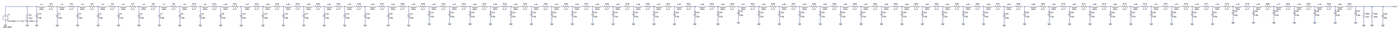
[diagram p0: schematic 64 cell_pc=1p.asc, whole sheet]
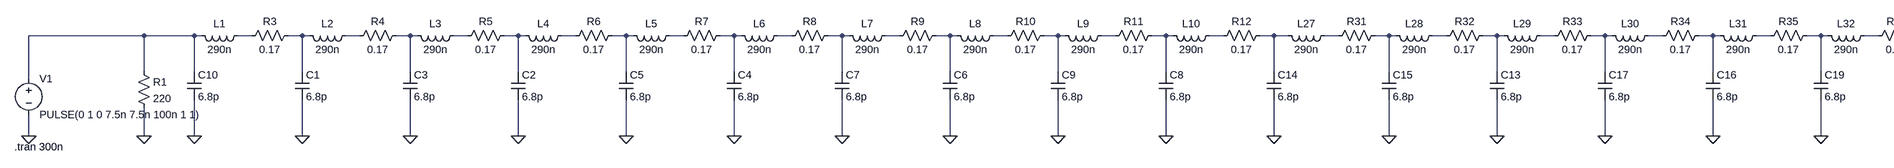
[diagram p1: schematic 64 cell_pc=1p.asc, part, row 1 of 1, column 1 of 4]
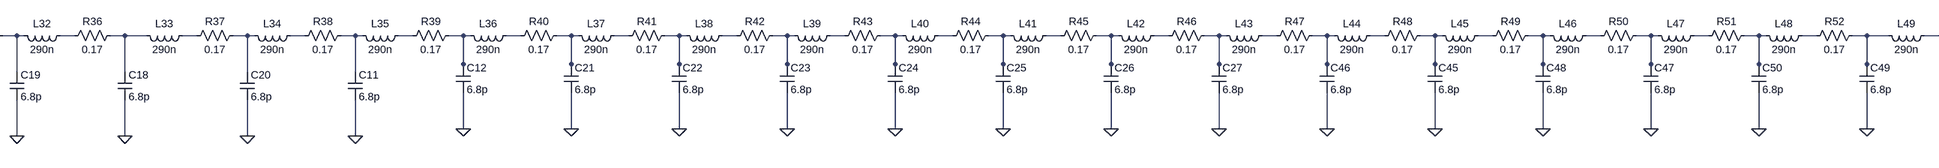
[diagram p2: schematic 64 cell_pc=1p.asc, part, row 1 of 1, column 2 of 4]
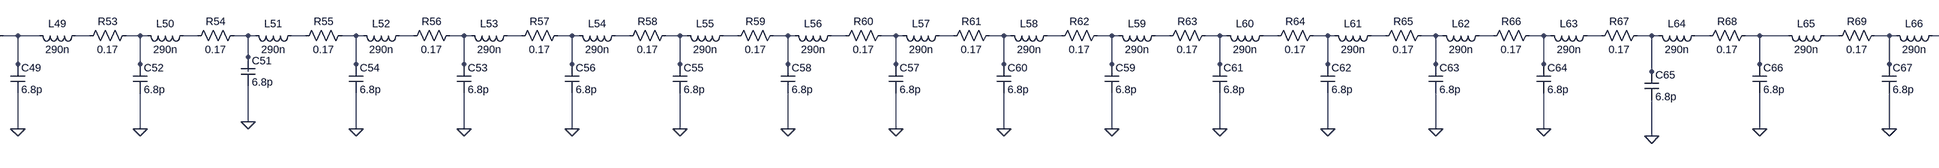
[diagram p3: schematic 64 cell_pc=1p.asc, part, row 1 of 1, column 3 of 4]
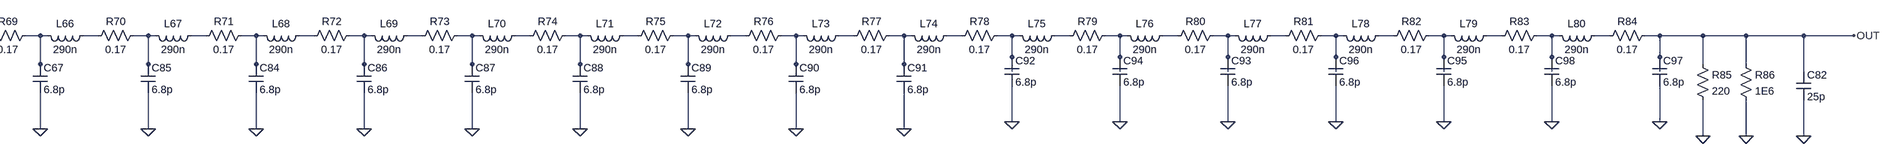
[diagram p4: schematic 64 cell_pc=1p.asc, part, row 1 of 1, column 4 of 4]
64 cell_pc=1p.asc, the LTspice schematic file:
Version 4
SHEET 1 14948 1092
WIRE -1152 48 -1408 48
WIRE -1040 48 -1152 48
WIRE -1024 48 -1040 48
WIRE -912 48 -944 48
WIRE -800 48 -832 48
WIRE -784 48 -800 48
WIRE -672 48 -704 48
WIRE -560 48 -592 48
WIRE -544 48 -560 48
WIRE -432 48 -464 48
WIRE -320 48 -352 48
WIRE -304 48 -320 48
WIRE -192 48 -224 48
WIRE -80 48 -112 48
WIRE -64 48 -80 48
WIRE 48 48 16 48
WIRE 160 48 128 48
WIRE 176 48 160 48
WIRE 288 48 256 48
WIRE 400 48 368 48
WIRE 416 48 400 48
WIRE 528 48 496 48
WIRE 640 48 608 48
WIRE 656 48 640 48
WIRE 768 48 736 48
WIRE 880 48 848 48
WIRE 896 48 880 48
WIRE 1008 48 976 48
WIRE 1120 48 1088 48
WIRE 1136 48 1120 48
WIRE 1248 48 1216 48
WIRE 1360 48 1328 48
WIRE 1392 48 1360 48
WIRE 1504 48 1472 48
WIRE 1616 48 1584 48
WIRE 1632 48 1616 48
WIRE 1744 48 1712 48
WIRE 1856 48 1824 48
WIRE 1872 48 1856 48
WIRE 1984 48 1952 48
WIRE 2096 48 2064 48
WIRE 2112 48 2096 48
WIRE 2224 48 2192 48
WIRE 2336 48 2304 48
WIRE 2352 48 2336 48
WIRE 2464 48 2432 48
WIRE 2576 48 2544 48
WIRE 2592 48 2576 48
WIRE 2704 48 2672 48
WIRE 2816 48 2784 48
WIRE 2864 48 2816 48
WIRE 2976 48 2944 48
WIRE 3088 48 3056 48
WIRE 3104 48 3088 48
WIRE 3216 48 3184 48
WIRE 3328 48 3296 48
WIRE 3344 48 3328 48
WIRE 3456 48 3424 48
WIRE 3568 48 3536 48
WIRE 3584 48 3568 48
WIRE 3696 48 3664 48
WIRE 3808 48 3776 48
WIRE 3824 48 3808 48
WIRE 3936 48 3904 48
WIRE 4048 48 4016 48
WIRE 4064 48 4048 48
WIRE 4176 48 4144 48
WIRE 4288 48 4256 48
WIRE 4304 48 4288 48
WIRE 4416 48 4384 48
WIRE 4528 48 4496 48
WIRE 4544 48 4528 48
WIRE 4656 48 4624 48
WIRE 4768 48 4736 48
WIRE 4784 48 4768 48
WIRE 4896 48 4864 48
WIRE 5008 48 4976 48
WIRE 5024 48 5008 48
WIRE 5136 48 5104 48
WIRE 5248 48 5216 48
WIRE 5264 48 5248 48
WIRE 5376 48 5344 48
WIRE 5488 48 5456 48
WIRE 5504 48 5488 48
WIRE 5616 48 5584 48
WIRE 5728 48 5696 48
WIRE 5744 48 5728 48
WIRE 5856 48 5824 48
WIRE 5968 48 5936 48
WIRE 5984 48 5968 48
WIRE 6096 48 6064 48
WIRE 6208 48 6176 48
WIRE 6224 48 6208 48
WIRE 6336 48 6304 48
WIRE 6448 48 6416 48
WIRE 6464 48 6448 48
WIRE 6576 48 6544 48
WIRE 6688 48 6656 48
WIRE 6736 48 6688 48
WIRE 6848 48 6816 48
WIRE 6960 48 6928 48
WIRE 6976 48 6960 48
WIRE 7088 48 7056 48
WIRE 7200 48 7168 48
WIRE 7216 48 7200 48
WIRE 7328 48 7296 48
WIRE 7440 48 7408 48
WIRE 7456 48 7440 48
WIRE 7568 48 7536 48
WIRE 7680 48 7648 48
WIRE 7696 48 7680 48
WIRE 7808 48 7776 48
WIRE 7920 48 7888 48
WIRE 7936 48 7920 48
WIRE 8048 48 8016 48
WIRE 8160 48 8128 48
WIRE 8176 48 8160 48
WIRE 8288 48 8256 48
WIRE 8400 48 8368 48
WIRE 8416 48 8400 48
WIRE 8528 48 8496 48
WIRE 8640 48 8608 48
WIRE 8656 48 8640 48
WIRE 8768 48 8736 48
WIRE 8880 48 8848 48
WIRE 8896 48 8880 48
WIRE 9008 48 8976 48
WIRE 9120 48 9088 48
WIRE 9136 48 9120 48
WIRE 9248 48 9216 48
WIRE 9360 48 9328 48
WIRE 9376 48 9360 48
WIRE 9488 48 9456 48
WIRE 9600 48 9568 48
WIRE 9616 48 9600 48
WIRE 9728 48 9696 48
WIRE 9840 48 9808 48
WIRE 9856 48 9840 48
WIRE 9968 48 9936 48
WIRE 10080 48 10048 48
WIRE 10096 48 10080 48
WIRE 10208 48 10176 48
WIRE 10320 48 10288 48
WIRE 10336 48 10320 48
WIRE 10448 48 10416 48
WIRE 10560 48 10528 48
WIRE 10624 48 10560 48
WIRE 10736 48 10704 48
WIRE 10848 48 10816 48
WIRE 10864 48 10848 48
WIRE 10976 48 10944 48
WIRE 11088 48 11056 48
WIRE 11104 48 11088 48
WIRE 11216 48 11184 48
WIRE 11328 48 11296 48
WIRE 11344 48 11328 48
WIRE 11456 48 11424 48
WIRE 11568 48 11536 48
WIRE 11584 48 11568 48
WIRE 11696 48 11664 48
WIRE 11808 48 11776 48
WIRE 11824 48 11808 48
WIRE 11936 48 11904 48
WIRE 12048 48 12016 48
WIRE 12064 48 12048 48
WIRE 12176 48 12144 48
WIRE 12288 48 12256 48
WIRE 12304 48 12288 48
WIRE 12416 48 12384 48
WIRE 12528 48 12496 48
WIRE 12544 48 12528 48
WIRE 12656 48 12624 48
WIRE 12768 48 12736 48
WIRE 12784 48 12768 48
WIRE 12896 48 12864 48
WIRE 13008 48 12976 48
WIRE 13024 48 13008 48
WIRE 13136 48 13104 48
WIRE 13248 48 13216 48
WIRE 13264 48 13248 48
WIRE 13376 48 13344 48
WIRE 13488 48 13456 48
WIRE 13504 48 13488 48
WIRE 13616 48 13584 48
WIRE 13728 48 13696 48
WIRE 13744 48 13728 48
WIRE 13856 48 13824 48
WIRE 13968 48 13936 48
WIRE 13984 48 13968 48
WIRE 14096 48 14064 48
WIRE 14208 48 14176 48
WIRE 14224 48 14208 48
WIRE 14336 48 14304 48
WIRE 14448 48 14416 48
WIRE 14544 48 14448 48
WIRE 14640 48 14544 48
WIRE 14768 48 14640 48
WIRE 14880 48 14768 48
WIRE 7200 96 7200 48
WIRE 13008 96 13008 48
WIRE 13248 96 13248 48
WIRE 13488 96 13488 48
WIRE 13728 96 13728 48
WIRE 13968 96 13968 48
WIRE 14208 96 14208 48
WIRE 14448 96 14448 48
WIRE 3568 112 3568 48
WIRE 3808 112 3808 48
WIRE 4048 112 4048 48
WIRE 4288 112 4288 48
WIRE 4528 112 4528 48
WIRE 4768 112 4768 48
WIRE 5008 112 5008 48
WIRE 5248 112 5248 48
WIRE 5488 112 5488 48
WIRE 5728 112 5728 48
WIRE 5968 112 5968 48
WIRE 6208 112 6208 48
WIRE 6448 112 6448 48
WIRE 6688 112 6688 48
WIRE 6960 112 6960 48
WIRE 7440 112 7440 48
WIRE 7680 112 7680 48
WIRE 7920 112 7920 48
WIRE 8160 112 8160 48
WIRE 8400 112 8400 48
WIRE 8640 112 8640 48
WIRE 8880 112 8880 48
WIRE 9120 112 9120 48
WIRE 9360 112 9360 48
WIRE 9600 112 9600 48
WIRE 9840 112 9840 48
WIRE 10080 112 10080 48
WIRE 10560 112 10560 48
WIRE 10848 112 10848 48
WIRE 11088 112 11088 48
WIRE 11328 112 11328 48
WIRE 11568 112 11568 48
WIRE 11808 112 11808 48
WIRE 12048 112 12048 48
WIRE 12288 112 12288 48
WIRE 12528 112 12528 48
WIRE 12768 112 12768 48
WIRE 14544 112 14544 48
WIRE 14640 112 14640 48
WIRE -1152 128 -1152 48
WIRE -1040 128 -1040 48
WIRE -800 128 -800 48
WIRE -560 128 -560 48
WIRE -320 128 -320 48
WIRE -80 128 -80 48
WIRE 160 128 160 48
WIRE 400 128 400 48
WIRE 640 128 640 48
WIRE 880 128 880 48
WIRE 1120 128 1120 48
WIRE 1360 128 1360 48
WIRE 1616 128 1616 48
WIRE 1856 128 1856 48
WIRE 2096 128 2096 48
WIRE 2336 128 2336 48
WIRE 2576 128 2576 48
WIRE 2816 128 2816 48
WIRE 3088 128 3088 48
WIRE 3328 128 3328 48
WIRE 3568 128 3568 112
WIRE 3808 128 3808 112
WIRE 4048 128 4048 112
WIRE 4288 128 4288 112
WIRE 4528 128 4528 112
WIRE 4768 128 4768 112
WIRE 5008 128 5008 112
WIRE 5248 128 5248 112
WIRE 5488 128 5488 112
WIRE 5728 128 5728 112
WIRE 5968 128 5968 112
WIRE 6208 128 6208 112
WIRE 6448 128 6448 112
WIRE 6688 128 6688 112
WIRE 6960 128 6960 112
WIRE 7200 128 7200 96
WIRE 7440 128 7440 112
WIRE 7680 128 7680 112
WIRE 7920 128 7920 112
WIRE 8160 128 8160 112
WIRE 8400 128 8400 112
WIRE 8640 128 8640 112
WIRE 8880 128 8880 112
WIRE 9120 128 9120 112
WIRE 9360 128 9360 112
WIRE 9600 128 9600 112
WIRE 9840 128 9840 112
WIRE 10080 128 10080 112
WIRE 10320 128 10320 48
WIRE 10560 128 10560 112
WIRE 10848 128 10848 112
WIRE 11088 128 11088 112
WIRE 11328 128 11328 112
WIRE 11568 128 11568 112
WIRE 11808 128 11808 112
WIRE 12048 128 12048 112
WIRE 12288 128 12288 112
WIRE 12528 128 12528 112
WIRE 12768 128 12768 112
WIRE 13008 128 13008 96
WIRE 13248 128 13248 96
WIRE 13488 128 13488 96
WIRE 13728 128 13728 96
WIRE 13968 128 13968 96
WIRE 14208 128 14208 96
WIRE 14448 128 14448 96
WIRE 14768 128 14768 48
WIRE -1408 144 -1408 48
WIRE 10320 144 10320 128
WIRE 7200 240 7200 160
WIRE 13008 240 13008 160
WIRE 13248 240 13248 160
WIRE 13488 240 13488 160
WIRE 13728 240 13728 160
WIRE 13968 240 13968 160
WIRE 14208 240 14208 160
WIRE 14448 240 14448 160
WIRE 3568 256 3568 176
WIRE 3808 256 3808 176
WIRE 4048 256 4048 176
WIRE 4288 256 4288 176
WIRE 4528 256 4528 176
WIRE 4768 256 4768 176
WIRE 5008 256 5008 176
WIRE 5248 256 5248 176
WIRE 5488 256 5488 176
WIRE 5728 256 5728 176
WIRE 5968 256 5968 176
WIRE 6208 256 6208 176
WIRE 6448 256 6448 176
WIRE 6688 256 6688 176
WIRE 6960 256 6960 176
WIRE 7440 256 7440 176
WIRE 7680 256 7680 176
WIRE 7920 256 7920 176
WIRE 8160 256 8160 176
WIRE 8400 256 8400 176
WIRE 8640 256 8640 176
WIRE 8880 256 8880 176
WIRE 9120 256 9120 176
WIRE 9360 256 9360 176
WIRE 9600 256 9600 176
WIRE 9840 256 9840 176
WIRE 10080 256 10080 176
WIRE 10560 256 10560 176
WIRE 10848 256 10848 176
WIRE 11088 256 11088 176
WIRE 11328 256 11328 176
WIRE 11568 256 11568 176
WIRE 11808 256 11808 176
WIRE 12048 256 12048 176
WIRE 12288 256 12288 176
WIRE 12528 256 12528 176
WIRE 12768 256 12768 176
WIRE -1408 272 -1408 224
WIRE -1152 272 -1152 208
WIRE -1040 272 -1040 192
WIRE -800 272 -800 192
WIRE -560 272 -560 192
WIRE -320 272 -320 192
WIRE -80 272 -80 192
WIRE 160 272 160 192
WIRE 400 272 400 192
WIRE 640 272 640 192
WIRE 880 272 880 192
WIRE 1120 272 1120 192
WIRE 1360 272 1360 192
WIRE 1616 272 1616 192
WIRE 1856 272 1856 192
WIRE 2096 272 2096 192
WIRE 2336 272 2336 192
WIRE 2576 272 2576 192
WIRE 2816 272 2816 192
WIRE 3088 272 3088 192
WIRE 3328 272 3328 192
WIRE 10320 272 10320 192
WIRE 14544 272 14544 192
WIRE 14640 272 14640 192
WIRE 14768 272 14768 192
FLAG -1408 272 0
FLAG -1040 272 0
FLAG -800 272 0
FLAG 14544 272 0
FLAG 14640 272 0
FLAG 14768 272 0
FLAG 14880 48 OUT
FLAG -1152 272 0
FLAG -560 272 0
FLAG -320 272 0
FLAG -80 272 0
FLAG 160 272 0
FLAG 400 272 0
FLAG 640 272 0
FLAG 880 272 0
FLAG 1120 272 0
FLAG 1360 272 0
FLAG 1616 272 0
FLAG 1856 272 0
FLAG 2096 272 0
FLAG 2336 272 0
FLAG 2576 272 0
FLAG 2816 272 0
FLAG 3088 272 0
FLAG 5488 256 0
FLAG 5728 256 0
FLAG 5968 256 0
FLAG 6208 256 0
FLAG 6448 256 0
FLAG 6688 256 0
FLAG 7200 240 0
FLAG 6960 256 0
FLAG 7440 256 0
FLAG 7680 256 0
FLAG 7920 256 0
FLAG 8160 256 0
FLAG 8400 256 0
FLAG 8640 256 0
FLAG 8880 256 0
FLAG 9120 256 0
FLAG 9360 256 0
FLAG 9600 256 0
FLAG 9840 256 0
FLAG 10080 256 0
FLAG 10320 272 0
FLAG 10560 256 0
FLAG 10848 256 0
FLAG 13248 240 0
FLAG 13488 240 0
FLAG 13728 240 0
FLAG 13968 240 0
FLAG 14208 240 0
FLAG 14448 240 0
FLAG 11088 256 0
FLAG 11328 256 0
FLAG 11568 256 0
FLAG 11808 256 0
FLAG 12048 256 0
FLAG 12288 256 0
FLAG 12528 256 0
FLAG 12768 256 0
FLAG 13008 240 0
FLAG 3328 272 0
FLAG 3568 256 0
FLAG 3808 256 0
FLAG 4048 256 0
FLAG 4288 256 0
FLAG 4528 256 0
FLAG 4768 256 0
FLAG 5008 256 0
FLAG 5248 256 0
SYMBOL voltage -1408 128 R0
WINDOW 123 0 0 Left 0
WINDOW 39 0 0 Left 0
SYMATTR InstName V1
SYMATTR Value PULSE(0 1 0 7.5n 7.5n 100n 1 1)
SYMBOL ind -928 32 R90
WINDOW 0 5 56 VBottom 2
WINDOW 3 32 56 VTop 2
SYMATTR InstName L1
SYMATTR Value 290n
SYMBOL res -816 32 R90
WINDOW 0 0 56 VBottom 2
WINDOW 3 32 56 VTop 2
SYMATTR InstName R3
SYMATTR Value 0.17
SYMBOL cap -816 128 R0
SYMATTR InstName C1
SYMATTR Value 6.8p
SYMATTR SpiceLine Cpar=1p
SYMBOL ind -688 32 R90
WINDOW 0 5 56 VBottom 2
WINDOW 3 32 56 VTop 2
SYMATTR InstName L2
SYMATTR Value 290n
SYMBOL res -576 32 R90
WINDOW 0 0 56 VBottom 2
WINDOW 3 32 56 VTop 2
SYMATTR InstName R4
SYMATTR Value 0.17
SYMBOL ind -448 32 R90
WINDOW 0 5 56 VBottom 2
WINDOW 3 32 56 VTop 2
SYMATTR InstName L3
SYMATTR Value 290n
SYMBOL res -336 32 R90
WINDOW 0 0 56 VBottom 2
WINDOW 3 32 56 VTop 2
SYMATTR InstName R5
SYMATTR Value 0.17
SYMBOL ind -208 32 R90
WINDOW 0 5 56 VBottom 2
WINDOW 3 32 56 VTop 2
SYMATTR InstName L4
SYMATTR Value 290n
SYMBOL res -96 32 R90
WINDOW 0 0 56 VBottom 2
WINDOW 3 32 56 VTop 2
SYMATTR InstName R6
SYMATTR Value 0.17
SYMBOL ind 32 32 R90
WINDOW 0 5 56 VBottom 2
WINDOW 3 32 56 VTop 2
SYMATTR InstName L5
SYMATTR Value 290n
SYMBOL res 144 32 R90
WINDOW 0 0 56 VBottom 2
WINDOW 3 32 56 VTop 2
SYMATTR InstName R7
SYMATTR Value 0.17
SYMBOL ind 272 32 R90
WINDOW 0 5 56 VBottom 2
WINDOW 3 32 56 VTop 2
SYMATTR InstName L6
SYMATTR Value 290n
SYMBOL res 384 32 R90
WINDOW 0 0 56 VBottom 2
WINDOW 3 32 56 VTop 2
SYMATTR InstName R8
SYMATTR Value 0.17
SYMBOL ind 512 32 R90
WINDOW 0 5 56 VBottom 2
WINDOW 3 32 56 VTop 2
SYMATTR InstName L7
SYMATTR Value 290n
SYMBOL res 624 32 R90
WINDOW 0 0 56 VBottom 2
WINDOW 3 32 56 VTop 2
SYMATTR InstName R9
SYMATTR Value 0.17
SYMBOL ind 752 32 R90
WINDOW 0 5 56 VBottom 2
WINDOW 3 32 56 VTop 2
SYMATTR InstName L8
SYMATTR Value 290n
SYMBOL res 864 32 R90
WINDOW 0 0 56 VBottom 2
WINDOW 3 32 56 VTop 2
SYMATTR InstName R10
SYMATTR Value 0.17
SYMBOL ind 992 32 R90
WINDOW 0 5 56 VBottom 2
WINDOW 3 32 56 VTop 2
SYMATTR InstName L9
SYMATTR Value 290n
SYMBOL res 1104 32 R90
WINDOW 0 0 56 VBottom 2
WINDOW 3 32 56 VTop 2
SYMATTR InstName R11
SYMATTR Value 0.17
SYMBOL ind 1232 32 R90
WINDOW 0 5 56 VBottom 2
WINDOW 3 32 56 VTop 2
SYMATTR InstName L10
SYMATTR Value 290n
SYMBOL res 1344 32 R90
WINDOW 0 0 56 VBottom 2
WINDOW 3 32 56 VTop 2
SYMATTR InstName R12
SYMATTR Value 0.17
SYMBOL ind 1488 32 R90
WINDOW 0 5 56 VBottom 2
WINDOW 3 32 56 VTop 2
SYMATTR InstName L27
SYMATTR Value 290n
SYMBOL res 1600 32 R90
WINDOW 0 0 56 VBottom 2
WINDOW 3 32 56 VTop 2
SYMATTR InstName R31
SYMATTR Value 0.17
SYMBOL ind 1728 32 R90
WINDOW 0 5 56 VBottom 2
WINDOW 3 32 56 VTop 2
SYMATTR InstName L28
SYMATTR Value 290n
SYMBOL res 1840 32 R90
WINDOW 0 0 56 VBottom 2
WINDOW 3 32 56 VTop 2
SYMATTR InstName R32
SYMATTR Value 0.17
SYMBOL ind 1968 32 R90
WINDOW 0 5 56 VBottom 2
WINDOW 3 32 56 VTop 2
SYMATTR InstName L29
SYMATTR Value 290n
SYMBOL res 2080 32 R90
WINDOW 0 0 56 VBottom 2
WINDOW 3 32 56 VTop 2
SYMATTR InstName R33
SYMATTR Value 0.17
SYMBOL ind 2208 32 R90
WINDOW 0 5 56 VBottom 2
WINDOW 3 32 56 VTop 2
SYMATTR InstName L30
SYMATTR Value 290n
SYMBOL res 2320 32 R90
WINDOW 0 0 56 VBottom 2
WINDOW 3 32 56 VTop 2
SYMATTR InstName R34
SYMATTR Value 0.17
SYMBOL ind 2448 32 R90
WINDOW 0 5 56 VBottom 2
WINDOW 3 32 56 VTop 2
SYMATTR InstName L31
SYMATTR Value 290n
SYMBOL res 2560 32 R90
WINDOW 0 0 56 VBottom 2
WINDOW 3 32 56 VTop 2
SYMATTR InstName R35
SYMATTR Value 0.17
SYMBOL ind 2688 32 R90
WINDOW 0 5 56 VBottom 2
WINDOW 3 32 56 VTop 2
SYMATTR InstName L32
SYMATTR Value 290n
SYMBOL res 2800 32 R90
WINDOW 0 0 56 VBottom 2
WINDOW 3 32 56 VTop 2
SYMATTR InstName R36
SYMATTR Value 0.17
SYMBOL ind 2960 32 R90
WINDOW 0 5 56 VBottom 2
WINDOW 3 32 56 VTop 2
SYMATTR InstName L33
SYMATTR Value 290n
SYMBOL res 3072 32 R90
WINDOW 0 0 56 VBottom 2
WINDOW 3 32 56 VTop 2
SYMATTR InstName R37
SYMATTR Value 0.17
SYMBOL ind 3200 32 R90
WINDOW 0 5 56 VBottom 2
WINDOW 3 32 56 VTop 2
SYMATTR InstName L34
SYMATTR Value 290n
SYMBOL res 3312 32 R90
WINDOW 0 0 56 VBottom 2
WINDOW 3 32 56 VTop 2
SYMATTR InstName R38
SYMATTR Value 0.17
SYMBOL ind 3440 32 R90
WINDOW 0 5 56 VBottom 2
WINDOW 3 32 56 VTop 2
SYMATTR InstName L35
SYMATTR Value 290n
SYMBOL res 3552 32 R90
WINDOW 0 0 56 VBottom 2
WINDOW 3 32 56 VTop 2
SYMATTR InstName R39
SYMATTR Value 0.17
SYMBOL ind 3680 32 R90
WINDOW 0 5 56 VBottom 2
WINDOW 3 32 56 VTop 2
SYMATTR InstName L36
SYMATTR Value 290n
SYMBOL res 3792 32 R90
WINDOW 0 0 56 VBottom 2
WINDOW 3 32 56 VTop 2
SYMATTR InstName R40
SYMATTR Value 0.17
SYMBOL ind 3920 32 R90
WINDOW 0 5 56 VBottom 2
WINDOW 3 32 56 VTop 2
SYMATTR InstName L37
SYMATTR Value 290n
SYMBOL res 4032 32 R90
WINDOW 0 0 56 VBottom 2
WINDOW 3 32 56 VTop 2
SYMATTR InstName R41
SYMATTR Value 0.17
SYMBOL ind 4160 32 R90
WINDOW 0 5 56 VBottom 2
WINDOW 3 32 56 VTop 2
SYMATTR InstName L38
SYMATTR Value 290n
SYMBOL res 4272 32 R90
WINDOW 0 0 56 VBottom 2
WINDOW 3 32 56 VTop 2
SYMATTR InstName R42
SYMATTR Value 0.17
SYMBOL ind 4400 32 R90
WINDOW 0 5 56 VBottom 2
WINDOW 3 32 56 VTop 2
SYMATTR InstName L39
SYMATTR Value 290n
SYMBOL res 4512 32 R90
WINDOW 0 0 56 VBottom 2
WINDOW 3 32 56 VTop 2
SYMATTR InstName R43
SYMATTR Value 0.17
SYMBOL ind 4640 32 R90
WINDOW 0 5 56 VBottom 2
WINDOW 3 32 56 VTop 2
SYMATTR InstName L40
SYMATTR Value 290n
SYMBOL res 4752 32 R90
WINDOW 0 0 56 VBottom 2
WINDOW 3 32 56 VTop 2
SYMATTR InstName R44
SYMATTR Value 0.17
SYMBOL ind 4880 32 R90
WINDOW 0 5 56 VBottom 2
WINDOW 3 32 56 VTop 2
SYMATTR InstName L41
SYMATTR Value 290n
SYMBOL res 4992 32 R90
WINDOW 0 0 56 VBottom 2
WINDOW 3 32 56 VTop 2
SYMATTR InstName R45
SYMATTR Value 0.17
SYMBOL ind 5120 32 R90
WINDOW 0 5 56 VBottom 2
WINDOW 3 32 56 VTop 2
SYMATTR InstName L42
SYMATTR Value 290n
SYMBOL res 5232 32 R90
WINDOW 0 0 56 VBottom 2
WINDOW 3 32 56 VTop 2
SYMATTR InstName R46
SYMATTR Value 0.17
SYMBOL ind 5360 32 R90
WINDOW 0 5 56 VBottom 2
WINDOW 3 32 56 VTop 2
SYMATTR InstName L43
SYMATTR Value 290n
SYMBOL res 5472 32 R90
WINDOW 0 0 56 VBottom 2
WINDOW 3 32 56 VTop 2
SYMATTR InstName R47
SYMATTR Value 0.17
SYMBOL ind 5600 32 R90
WINDOW 0 5 56 VBottom 2
WINDOW 3 32 56 VTop 2
SYMATTR InstName L44
SYMATTR Value 290n
SYMBOL res 5712 32 R90
WINDOW 0 0 56 VBottom 2
WINDOW 3 32 56 VTop 2
SYMATTR InstName R48
SYMATTR Value 0.17
SYMBOL ind 5840 32 R90
WINDOW 0 5 56 VBottom 2
WINDOW 3 32 56 VTop 2
SYMATTR InstName L45
SYMATTR Value 290n
SYMBOL res 5952 32 R90
WINDOW 0 0 56 VBottom 2
WINDOW 3 32 56 VTop 2
SYMATTR InstName R49
SYMATTR Value 0.17
SYMBOL ind 6080 32 R90
WINDOW 0 5 56 VBottom 2
WINDOW 3 32 56 VTop 2
SYMATTR InstName L46
SYMATTR Value 290n
SYMBOL res 6192 32 R90
WINDOW 0 0 56 VBottom 2
WINDOW 3 32 56 VTop 2
SYMATTR InstName R50
SYMATTR Value 0.17
SYMBOL ind 6320 32 R90
WINDOW 0 5 56 VBottom 2
WINDOW 3 32 56 VTop 2
SYMATTR InstName L47
SYMATTR Value 290n
SYMBOL res 6432 32 R90
WINDOW 0 0 56 VBottom 2
WINDOW 3 32 56 VTop 2
SYMATTR InstName R51
SYMATTR Value 0.17
SYMBOL ind 6560 32 R90
WINDOW 0 5 56 VBottom 2
WINDOW 3 32 56 VTop 2
SYMATTR InstName L48
SYMATTR Value 290n
SYMBOL res 6672 32 R90
WINDOW 0 0 56 VBottom 2
WINDOW 3 32 56 VTop 2
SYMATTR InstName R52
SYMATTR Value 0.17
SYMBOL ind 6832 32 R90
WINDOW 0 5 56 VBottom 2
WINDOW 3 32 56 VTop 2
SYMATTR InstName L49
SYMATTR Value 290n
SYMBOL res 6944 32 R90
WINDOW 0 0 56 VBottom 2
WINDOW 3 32 56 VTop 2
SYMATTR InstName R53
SYMATTR Value 0.17
SYMBOL ind 7072 32 R90
WINDOW 0 5 56 VBottom 2
WINDOW 3 32 56 VTop 2
SYMATTR InstName L50
SYMATTR Value 290n
SYMBOL res 7184 32 R90
WINDOW 0 0 56 VBottom 2
WINDOW 3 32 56 VTop 2
SYMATTR InstName R54
SYMATTR Value 0.17
SYMBOL ind 7312 32 R90
WINDOW 0 5 56 VBottom 2
WINDOW 3 32 56 VTop 2
SYMATTR InstName L51
SYMATTR Value 290n
SYMBOL res 7424 32 R90
WINDOW 0 0 56 VBottom 2
WINDOW 3 32 56 VTop 2
SYMATTR InstName R55
SYMATTR Value 0.17
SYMBOL ind 7552 32 R90
WINDOW 0 5 56 VBottom 2
WINDOW 3 32 56 VTop 2
SYMATTR InstName L52
SYMATTR Value 290n
SYMBOL res 7664 32 R90
WINDOW 0 0 56 VBottom 2
WINDOW 3 32 56 VTop 2
SYMATTR InstName R56
SYMATTR Value 0.17
SYMBOL ind 7792 32 R90
WINDOW 0 5 56 VBottom 2
WINDOW 3 32 56 VTop 2
SYMATTR InstName L53
SYMATTR Value 290n
SYMBOL res 7904 32 R90
WINDOW 0 0 56 VBottom 2
WINDOW 3 32 56 VTop 2
SYMATTR InstName R57
SYMATTR Value 0.17
SYMBOL ind 8032 32 R90
WINDOW 0 5 56 VBottom 2
WINDOW 3 32 56 VTop 2
SYMATTR InstName L54
SYMATTR Value 290n
SYMBOL res 8144 32 R90
WINDOW 0 0 56 VBottom 2
WINDOW 3 32 56 VTop 2
SYMATTR InstName R58
SYMATTR Value 0.17
SYMBOL ind 8272 32 R90
WINDOW 0 5 56 VBottom 2
WINDOW 3 32 56 VTop 2
SYMATTR InstName L55
SYMATTR Value 290n
SYMBOL res 8384 32 R90
WINDOW 0 0 56 VBottom 2
WINDOW 3 32 56 VTop 2
SYMATTR InstName R59
SYMATTR Value 0.17
SYMBOL ind 8512 32 R90
WINDOW 0 5 56 VBottom 2
WINDOW 3 32 56 VTop 2
SYMATTR InstName L56
SYMATTR Value 290n
SYMBOL res 8624 32 R90
WINDOW 0 0 56 VBottom 2
WINDOW 3 32 56 VTop 2
SYMATTR InstName R60
SYMATTR Value 0.17
SYMBOL ind 8752 32 R90
WINDOW 0 5 56 VBottom 2
WINDOW 3 32 56 VTop 2
SYMATTR InstName L57
SYMATTR Value 290n
SYMBOL res 8864 32 R90
WINDOW 0 0 56 VBottom 2
WINDOW 3 32 56 VTop 2
SYMATTR InstName R61
SYMATTR Value 0.17
SYMBOL ind 8992 32 R90
WINDOW 0 5 56 VBottom 2
WINDOW 3 32 56 VTop 2
SYMATTR InstName L58
SYMATTR Value 290n
SYMBOL res 9104 32 R90
WINDOW 0 0 56 VBottom 2
WINDOW 3 32 56 VTop 2
SYMATTR InstName R62
SYMATTR Value 0.17
SYMBOL ind 9232 32 R90
WINDOW 0 5 56 VBottom 2
WINDOW 3 32 56 VTop 2
SYMATTR InstName L59
SYMATTR Value 290n
SYMBOL res 9344 32 R90
WINDOW 0 0 56 VBottom 2
WINDOW 3 32 56 VTop 2
SYMATTR InstName R63
SYMATTR Value 0.17
SYMBOL ind 9472 32 R90
WINDOW 0 5 56 VBottom 2
WINDOW 3 32 56 VTop 2
SYMATTR InstName L60
SYMATTR Value 290n
SYMBOL res 9584 32 R90
WINDOW 0 0 56 VBottom 2
WINDOW 3 32 56 VTop 2
SYMATTR InstName R64
SYMATTR Value 0.17
SYMBOL ind 9712 32 R90
WINDOW 0 5 56 VBottom 2
WINDOW 3 32 56 VTop 2
SYMATTR InstName L61
SYMATTR Value 290n
SYMBOL res 9824 32 R90
WINDOW 0 0 56 VBottom 2
WINDOW 3 32 56 VTop 2
SYMATTR InstName R65
SYMATTR Value 0.17
SYMBOL ind 9952 32 R90
WINDOW 0 5 56 VBottom 2
WINDOW 3 32 56 VTop 2
SYMATTR InstName L62
SYMATTR Value 290n
SYMBOL res 10064 32 R90
WINDOW 0 0 56 VBottom 2
WINDOW 3 32 56 VTop 2
SYMATTR InstName R66
SYMATTR Value 0.17
SYMBOL ind 10192 32 R90
WINDOW 0 5 56 VBottom 2
WINDOW 3 32 56 VTop 2
SYMATTR InstName L63
SYMATTR Value 290n
SYMBOL res 10304 32 R90
WINDOW 0 0 56 VBottom 2
WINDOW 3 32 56 VTop 2
SYMATTR InstName R67
SYMATTR Value 0.17
SYMBOL ind 10432 32 R90
WINDOW 0 5 56 VBottom 2
WINDOW 3 32 56 VTop 2
SYMATTR InstName L64
SYMATTR Value 290n
SYMBOL res 10544 32 R90
WINDOW 0 0 56 VBottom 2
WINDOW 3 32 56 VTop 2
SYMATTR InstName R68
SYMATTR Value 0.17
SYMBOL ind 10720 32 R90
WINDOW 0 5 56 VBottom 2
WINDOW 3 32 56 VTop 2
SYMATTR InstName L65
SYMATTR Value 290n
SYMBOL res 10832 32 R90
WINDOW 0 0 56 VBottom 2
WINDOW 3 32 56 VTop 2
SYMATTR InstName R69
SYMATTR Value 0.17
SYMBOL ind 10960 32 R90
WINDOW 0 5 56 VBottom 2
WINDOW 3 32 56 VTop 2
SYMATTR InstName L66
SYMATTR Value 290n
SYMBOL res 11072 32 R90
WINDOW 0 0 56 VBottom 2
WINDOW 3 32 56 VTop 2
SYMATTR InstName R70
SYMATTR Value 0.17
SYMBOL ind 11200 32 R90
WINDOW 0 5 56 VBottom 2
WINDOW 3 32 56 VTop 2
SYMATTR InstName L67
SYMATTR Value 290n
SYMBOL res 11312 32 R90
WINDOW 0 0 56 VBottom 2
WINDOW 3 32 56 VTop 2
SYMATTR InstName R71
SYMATTR Value 0.17
SYMBOL ind 11440 32 R90
WINDOW 0 5 56 VBottom 2
WINDOW 3 32 56 VTop 2
SYMATTR InstName L68
SYMATTR Value 290n
SYMBOL res 11552 32 R90
WINDOW 0 0 56 VBottom 2
WINDOW 3 32 56 VTop 2
SYMATTR InstName R72
SYMATTR Value 0.17
SYMBOL ind 11680 32 R90
WINDOW 0 5 56 VBottom 2
WINDOW 3 32 56 VTop 2
SYMATTR InstName L69
SYMATTR Value 290n
SYMBOL res 11792 32 R90
WINDOW 0 0 56 VBottom 2
WINDOW 3 32 56 VTop 2
SYMATTR InstName R73
SYMATTR Value 0.17
SYMBOL ind 11920 32 R90
WINDOW 0 5 56 VBottom 2
WINDOW 3 32 56 VTop 2
SYMATTR InstName L70
SYMATTR Value 290n
SYMBOL res 12032 32 R90
WINDOW 0 0 56 VBottom 2
WINDOW 3 32 56 VTop 2
SYMATTR InstName R74
SYMATTR Value 0.17
SYMBOL ind 12160 32 R90
WINDOW 0 5 56 VBottom 2
WINDOW 3 32 56 VTop 2
SYMATTR InstName L71
SYMATTR Value 290n
SYMBOL res 12272 32 R90
WINDOW 0 0 56 VBottom 2
WINDOW 3 32 56 VTop 2
SYMATTR InstName R75
SYMATTR Value 0.17
SYMBOL ind 12400 32 R90
WINDOW 0 5 56 VBottom 2
WINDOW 3 32 56 VTop 2
SYMATTR InstName L72
SYMATTR Value 290n
SYMBOL res 12512 32 R90
WINDOW 0 0 56 VBottom 2
WINDOW 3 32 56 VTop 2
SYMATTR InstName R76
SYMATTR Value 0.17
SYMBOL ind 12640 32 R90
WINDOW 0 5 56 VBottom 2
WINDOW 3 32 56 VTop 2
SYMATTR InstName L73
SYMATTR Value 290n
SYMBOL res 12752 32 R90
WINDOW 0 0 56 VBottom 2
WINDOW 3 32 56 VTop 2
SYMATTR InstName R77
SYMATTR Value 0.17
SYMBOL ind 12880 32 R90
WINDOW 0 5 56 VBottom 2
WINDOW 3 32 56 VTop 2
SYMATTR InstName L74
SYMATTR Value 290n
SYMBOL res 12992 32 R90
WINDOW 0 0 56 VBottom 2
WINDOW 3 32 56 VTop 2
SYMATTR InstName R78
SYMATTR Value 0.17
SYMBOL ind 13120 32 R90
WINDOW 0 5 56 VBottom 2
WINDOW 3 32 56 VTop 2
SYMATTR InstName L75
SYMATTR Value 290n
SYMBOL res 13232 32 R90
WINDOW 0 0 56 VBottom 2
WINDOW 3 32 56 VTop 2
SYMATTR InstName R79
SYMATTR Value 0.17
SYMBOL ind 13360 32 R90
WINDOW 0 5 56 VBottom 2
WINDOW 3 32 56 VTop 2
SYMATTR InstName L76
SYMATTR Value 290n
SYMBOL res 13472 32 R90
WINDOW 0 0 56 VBottom 2
WINDOW 3 32 56 VTop 2
SYMATTR InstName R80
SYMATTR Value 0.17
SYMBOL ind 13600 32 R90
WINDOW 0 5 56 VBottom 2
WINDOW 3 32 56 VTop 2
SYMATTR InstName L77
SYMATTR Value 290n
SYMBOL res 13712 32 R90
WINDOW 0 0 56 VBottom 2
WINDOW 3 32 56 VTop 2
SYMATTR InstName R81
SYMATTR Value 0.17
SYMBOL ind 13840 32 R90
WINDOW 0 5 56 VBottom 2
WINDOW 3 32 56 VTop 2
SYMATTR InstName L78
SYMATTR Value 290n
SYMBOL res 13952 32 R90
WINDOW 0 0 56 VBottom 2
WINDOW 3 32 56 VTop 2
SYMATTR InstName R82
SYMATTR Value 0.17
SYMBOL ind 14080 32 R90
WINDOW 0 5 56 VBottom 2
WINDOW 3 32 56 VTop 2
SYMATTR InstName L79
SYMATTR Value 290n
SYMBOL res 14192 32 R90
WINDOW 0 0 56 VBottom 2
WINDOW 3 32 56 VTop 2
SYMATTR InstName R83
SYMATTR Value 0.17
SYMBOL ind 14320 32 R90
WINDOW 0 5 56 VBottom 2
WINDOW 3 32 56 VTop 2
SYMATTR InstName L80
SYMATTR Value 290n
SYMBOL res 14432 32 R90
WINDOW 0 0 56 VBottom 2
WINDOW 3 32 56 VTop 2
SYMATTR InstName R84
SYMATTR Value 0.17
SYMBOL res 14528 96 R0
SYMATTR InstName R85
SYMATTR Value 220
SYMBOL res 14624 96 R0
SYMATTR InstName R86
SYMATTR Value 1E6
SYMBOL cap 14752 128 R0
SYMATTR InstName C82
SYMATTR Value 25p
SYMBOL res -1168 112 R0
SYMATTR InstName R1
SYMATTR Value 220
SYMBOL cap -1056 128 R0
SYMATTR InstName C10
SYMATTR Value 6.8p
SYMATTR SpiceLine Cpar=1p
SYMBOL cap -336 128 R0
SYMATTR InstName C2
SYMATTR Value 6.8p
SYMATTR SpiceLine Cpar=1p
SYMBOL cap -576 128 R0
SYMATTR InstName C3
SYMATTR Value 6.8p
SYMATTR SpiceLine Cpar=1p
SYMBOL cap 144 128 R0
SYMATTR InstName C4
SYMATTR Value 6.8p
SYMATTR SpiceLine Cpar=1p
SYMBOL cap -96 128 R0
SYMATTR InstName C5
SYMATTR Value 6.8p
SYMATTR SpiceLine Cpar=1p
SYMBOL cap 624 128 R0
SYMATTR InstName C6
SYMATTR Value 6.8p
SYMATTR SpiceLine Cpar=1p
SYMBOL cap 384 128 R0
SYMATTR InstName C7
SYMATTR Value 6.8p
SYMATTR SpiceLine Cpar=1p
SYMBOL cap 1104 128 R0
SYMATTR InstName C8
SYMATTR Value 6.8p
SYMATTR SpiceLine Cpar=1p
SYMBOL cap 864 128 R0
SYMATTR InstName C9
SYMATTR Value 6.8p
SYMATTR SpiceLine Cpar=1p
SYMBOL cap 1344 128 R0
SYMATTR InstName C14
SYMATTR Value 6.8p
SYMATTR SpiceLine Cpar=1p
SYMBOL cap 1840 128 R0
SYMATTR InstName C13
SYMATTR Value 6.8p
SYMATTR SpiceLine Cpar=1p
SYMBOL cap 1600 128 R0
SYMATTR InstName C15
SYMATTR Value 6.8p
SYMATTR SpiceLine Cpar=1p
SYMBOL cap 2320 128 R0
SYMATTR InstName C16
SYMATTR Value 6.8p
SYMATTR SpiceLine Cpar=1p
SYMBOL cap 2080 128 R0
SYMATTR InstName C17
SYMATTR Value 6.8p
SYMATTR SpiceLine Cpar=1p
SYMBOL cap 2800 128 R0
SYMATTR InstName C18
SYMATTR Value 6.8p
SYMATTR SpiceLine Cpar=1p
SYMBOL cap 2560 128 R0
SYMATTR InstName C19
SYMATTR Value 6.8p
SYMATTR SpiceLine Cpar=1p
SYMBOL cap 3072 128 R0
SYMATTR InstName C20
SYMATTR Value 6.8p
SYMATTR SpiceLine Cpar=1p
SYMBOL cap 5712 112 R0
SYMATTR InstName C45
SYMATTR Value 6.8p
SYMATTR SpiceLine Cpar=1p
SYMBOL cap 5472 112 R0
SYMATTR InstName C46
SYMATTR Value 6.8p
SYMATTR SpiceLine Cpar=1p
SYMBOL cap 6192 112 R0
SYMATTR InstName C47
SYMATTR Value 6.8p
SYMATTR SpiceLine Cpar=1p
SYMBOL cap 5952 112 R0
SYMATTR InstName C48
SYMATTR Value 6.8p
SYMATTR SpiceLine Cpar=1p
SYMBOL cap 6672 112 R0
SYMATTR InstName C49
SYMATTR Value 6.8p
SYMATTR SpiceLine Cpar=1p
SYMBOL cap 6432 112 R0
SYMATTR InstName C50
SYMATTR Value 6.8p
SYMATTR SpiceLine Cpar=1p
SYMBOL cap 7184 96 R0
SYMATTR InstName C51
SYMATTR Value 6.8p
SYMATTR SpiceLine Cpar=1p
SYMBOL cap 6944 112 R0
SYMATTR InstName C52
SYMATTR Value 6.8p
SYMATTR SpiceLine Cpar=1p
SYMBOL cap 7664 112 R0
SYMATTR InstName C53
SYMATTR Value 6.8p
SYMATTR SpiceLine Cpar=1p
SYMBOL cap 7424 112 R0
SYMATTR InstName C54
SYMATTR Value 6.8p
SYMATTR SpiceLine Cpar=1p
SYMBOL cap 8144 112 R0
SYMATTR InstName C55
SYMATTR Value 6.8p
SYMATTR SpiceLine Cpar=1p
SYMBOL cap 7904 112 R0
SYMATTR InstName C56
SYMATTR Value 6.8p
SYMATTR SpiceLine Cpar=1p
SYMBOL cap 8624 112 R0
SYMATTR InstName C57
SYMATTR Value 6.8p
SYMATTR SpiceLine Cpar=1p
SYMBOL cap 8384 112 R0
SYMATTR InstName C58
SYMATTR Value 6.8p
SYMATTR SpiceLine Cpar=1p
SYMBOL cap 9104 112 R0
SYMATTR InstName C59
SYMATTR Value 6.8p
SYMATTR SpiceLine Cpar=1p
SYMBOL cap 8864 112 R0
SYMATTR InstName C60
SYMATTR Value 6.8p
SYMATTR SpiceLine Cpar=1p
SYMBOL cap 9344 112 R0
SYMATTR InstName C61
SYMATTR Value 6.8p
SYMATTR SpiceLine Cpar=1p
SYMBOL cap 9584 112 R0
SYMATTR InstName C62
SYMATTR Value 6.8p
SYMATTR SpiceLine Cpar=1p
SYMBOL cap 9824 112 R0
SYMATTR InstName C63
SYMATTR Value 6.8p
SYMATTR SpiceLine Cpar=1p
SYMBOL cap 10064 112 R0
SYMATTR InstName C64
SYMATTR Value 6.8p
SYMATTR SpiceLine Cpar=1p
SYMBOL cap 10304 128 R0
SYMATTR InstName C65
SYMATTR Value 6.8p
SYMATTR SpiceLine Cpar=1p
SYMBOL cap 10544 112 R0
SYMATTR InstName C66
SYMATTR Value 6.8p
SYMATTR SpiceLine Cpar=1p
SYMBOL cap 10832 112 R0
SYMATTR InstName C67
SYMATTR Value 6.8p
SYMATTR SpiceLine Cpar=1p
SYMBOL cap 13472 96 R0
SYMATTR InstName C93
SYMATTR Value 6.8p
SYMATTR SpiceLine Cpar=1p
SYMBOL cap 13232 96 R0
SYMATTR InstName C94
SYMATTR Value 6.8p
SYMATTR SpiceLine Cpar=1p
SYMBOL cap 13952 96 R0
SYMATTR InstName C95
SYMATTR Value 6.8p
SYMATTR SpiceLine Cpar=1p
SYMBOL cap 13712 96 R0
SYMATTR InstName C96
SYMATTR Value 6.8p
SYMATTR SpiceLine Cpar=1p
SYMBOL cap 14432 96 R0
SYMATTR InstName C97
SYMATTR Value 6.8p
SYMATTR SpiceLine Cpar=1p
SYMBOL cap 14192 96 R0
SYMATTR InstName C98
SYMATTR Value 6.8p
SYMATTR SpiceLine Cpar=1p
SYMBOL cap 11072 112 R0
SYMATTR InstName C85
SYMATTR Value 6.8p
SYMATTR SpiceLine Cpar=1p
SYMBOL cap 11312 112 R0
SYMATTR InstName C84
SYMATTR Value 6.8p
SYMATTR SpiceLine Cpar=1p
SYMBOL cap 11552 112 R0
SYMATTR InstName C86
SYMATTR Value 6.8p
SYMATTR SpiceLine Cpar=1p
SYMBOL cap 11792 112 R0
SYMATTR InstName C87
SYMATTR Value 6.8p
SYMATTR SpiceLine Cpar=1p
SYMBOL cap 12032 112 R0
SYMATTR InstName C88
SYMATTR Value 6.8p
SYMATTR SpiceLine Cpar=1p
SYMBOL cap 12272 112 R0
SYMATTR InstName C89
SYMATTR Value 6.8p
SYMATTR SpiceLine Cpar=1p
SYMBOL cap 12512 112 R0
SYMATTR InstName C90
SYMATTR Value 6.8p
SYMATTR SpiceLine Cpar=1p
SYMBOL cap 12752 112 R0
SYMATTR InstName C91
SYMATTR Value 6.8p
SYMATTR SpiceLine Cpar=1p
SYMBOL cap 12992 96 R0
SYMATTR InstName C92
SYMATTR Value 6.8p
SYMATTR SpiceLine Cpar=1p
SYMBOL cap 3312 128 R0
SYMATTR InstName C11
SYMATTR Value 6.8p
SYMATTR SpiceLine Cpar=1p
SYMBOL cap 3552 112 R0
SYMATTR InstName C12
SYMATTR Value 6.8p
SYMATTR SpiceLine Cpar=1p
SYMBOL cap 3792 112 R0
SYMATTR InstName C21
SYMATTR Value 6.8p
SYMATTR SpiceLine Cpar=1p
SYMBOL cap 4032 112 R0
SYMATTR InstName C22
SYMATTR Value 6.8p
SYMATTR SpiceLine Cpar=1p
SYMBOL cap 4272 112 R0
SYMATTR InstName C23
SYMATTR Value 6.8p
SYMATTR SpiceLine Cpar=1p
SYMBOL cap 4512 112 R0
SYMATTR InstName C24
SYMATTR Value 6.8p
SYMATTR SpiceLine Cpar=1p
SYMBOL cap 4752 112 R0
SYMATTR InstName C25
SYMATTR Value 6.8p
SYMATTR SpiceLine Cpar=1p
SYMBOL cap 4992 112 R0
SYMATTR InstName C26
SYMATTR Value 6.8p
SYMATTR SpiceLine Cpar=1p
SYMBOL cap 5232 112 R0
SYMATTR InstName C27
SYMATTR Value 6.8p
SYMATTR SpiceLine Cpar=1p
TEXT -1440 296 Left 2 !.tran 300n

The netlist it stands for:
* 64 cell_pc=1p.asc
V1 N001 0 PULSE(0 1 0 7.5n 7.5n 100n 1 1)
L1 N002 N001 290n
R3 N003 N002 0.17
C1 N003 0 6.8p Cpar=1p
L2 N004 N003 290n
R4 N005 N004 0.17
L3 N006 N005 290n
R5 N007 N006 0.17
L4 N008 N007 290n
R6 N009 N008 0.17
L5 N010 N009 290n
R7 N011 N010 0.17
L6 N012 N011 290n
R8 N013 N012 0.17
L7 N014 N013 290n
R9 N015 N014 0.17
L8 N016 N015 290n
R10 N017 N016 0.17
L9 N018 N017 290n
R11 N019 N018 0.17
L10 N020 N019 290n
R12 N021 N020 0.17
L27 N022 N021 290n
R31 N023 N022 0.17
L28 N024 N023 290n
R32 N025 N024 0.17
L29 N026 N025 290n
R33 N027 N026 0.17
L30 N028 N027 290n
R34 N029 N028 0.17
L31 N030 N029 290n
R35 N031 N030 0.17
L32 N032 N031 290n
R36 N033 N032 0.17
L33 N034 N033 290n
R37 N035 N034 0.17
L34 N036 N035 290n
R38 N037 N036 0.17
L35 N038 N037 290n
R39 N039 N038 0.17
L36 N040 N039 290n
R40 N041 N040 0.17
L37 N042 N041 290n
R41 N043 N042 0.17
L38 N044 N043 290n
R42 N045 N044 0.17
L39 N046 N045 290n
R43 N047 N046 0.17
L40 N048 N047 290n
R44 N049 N048 0.17
L41 N050 N049 290n
R45 N051 N050 0.17
L42 N052 N051 290n
R46 N053 N052 0.17
L43 N054 N053 290n
R47 N055 N054 0.17
L44 N056 N055 290n
R48 N057 N056 0.17
L45 N058 N057 290n
R49 N059 N058 0.17
L46 N060 N059 290n
R50 N061 N060 0.17
L47 N062 N061 290n
R51 N063 N062 0.17
L48 N064 N063 290n
R52 N065 N064 0.17
L49 N066 N065 290n
R53 N067 N066 0.17
L50 N068 N067 290n
R54 N069 N068 0.17
L51 N070 N069 290n
R55 N071 N070 0.17
L52 N072 N071 290n
R56 N073 N072 0.17
L53 N074 N073 290n
R57 N075 N074 0.17
L54 N076 N075 290n
R58 N077 N076 0.17
L55 N078 N077 290n
R59 N079 N078 0.17
L56 N080 N079 290n
R60 N081 N080 0.17
L57 N082 N081 290n
R61 N083 N082 0.17
L58 N084 N083 290n
R62 N085 N084 0.17
L59 N086 N085 290n
R63 N087 N086 0.17
L60 N088 N087 290n
R64 N089 N088 0.17
L61 N090 N089 290n
R65 N091 N090 0.17
L62 N092 N091 290n
R66 N093 N092 0.17
L63 N094 N093 290n
R67 N095 N094 0.17
L64 N096 N095 290n
R68 N097 N096 0.17
L65 N098 N097 290n
R69 N099 N098 0.17
L66 N100 N099 290n
R70 N101 N100 0.17
L67 N102 N101 290n
R71 N103 N102 0.17
L68 N104 N103 290n
R72 N105 N104 0.17
L69 N106 N105 290n
R73 N107 N106 0.17
L70 N108 N107 290n
R74 N109 N108 0.17
L71 N110 N109 290n
R75 N111 N110 0.17
L72 N112 N111 290n
R76 N113 N112 0.17
L73 N114 N113 290n
R77 N115 N114 0.17
L74 N116 N115 290n
R78 N117 N116 0.17
L75 N118 N117 290n
R79 N119 N118 0.17
L76 N120 N119 290n
R80 N121 N120 0.17
L77 N122 N121 290n
R81 N123 N122 0.17
L78 N124 N123 290n
R82 N125 N124 0.17
L79 N126 N125 290n
R83 N127 N126 0.17
L80 N128 N127 290n
R84 OUT N128 0.17
R85 OUT 0 220
R86 OUT 0 1E6
C82 OUT 0 25p
R1 N001 0 220
C10 N001 0 6.8p Cpar=1p
C2 N007 0 6.8p Cpar=1p
C3 N005 0 6.8p Cpar=1p
C4 N011 0 6.8p Cpar=1p
C5 N009 0 6.8p Cpar=1p
C6 N015 0 6.8p Cpar=1p
C7 N013 0 6.8p Cpar=1p
C8 N019 0 6.8p Cpar=1p
C9 N017 0 6.8p Cpar=1p
C14 N021 0 6.8p Cpar=1p
C13 N025 0 6.8p Cpar=1p
C15 N023 0 6.8p Cpar=1p
C16 N029 0 6.8p Cpar=1p
C17 N027 0 6.8p Cpar=1p
C18 N033 0 6.8p Cpar=1p
C19 N031 0 6.8p Cpar=1p
C20 N035 0 6.8p Cpar=1p
C45 N057 0 6.8p Cpar=1p
C46 N055 0 6.8p Cpar=1p
C47 N061 0 6.8p Cpar=1p
C48 N059 0 6.8p Cpar=1p
C49 N065 0 6.8p Cpar=1p
C50 N063 0 6.8p Cpar=1p
C51 N069 0 6.8p Cpar=1p
C52 N067 0 6.8p Cpar=1p
C53 N073 0 6.8p Cpar=1p
C54 N071 0 6.8p Cpar=1p
C55 N077 0 6.8p Cpar=1p
C56 N075 0 6.8p Cpar=1p
C57 N081 0 6.8p Cpar=1p
C58 N079 0 6.8p Cpar=1p
C59 N085 0 6.8p Cpar=1p
C60 N083 0 6.8p Cpar=1p
C61 N087 0 6.8p Cpar=1p
C62 N089 0 6.8p Cpar=1p
C63 N091 0 6.8p Cpar=1p
C64 N093 0 6.8p Cpar=1p
C65 N095 0 6.8p Cpar=1p
C66 N097 0 6.8p Cpar=1p
C67 N099 0 6.8p Cpar=1p
C93 N121 0 6.8p Cpar=1p
C94 N119 0 6.8p Cpar=1p
C95 N125 0 6.8p Cpar=1p
C96 N123 0 6.8p Cpar=1p
C97 OUT 0 6.8p Cpar=1p
C98 N127 0 6.8p Cpar=1p
C85 N101 0 6.8p Cpar=1p
C84 N103 0 6.8p Cpar=1p
C86 N105 0 6.8p Cpar=1p
C87 N107 0 6.8p Cpar=1p
C88 N109 0 6.8p Cpar=1p
C89 N111 0 6.8p Cpar=1p
C90 N113 0 6.8p Cpar=1p
C91 N115 0 6.8p Cpar=1p
C92 N117 0 6.8p Cpar=1p
C11 N037 0 6.8p Cpar=1p
C12 N039 0 6.8p Cpar=1p
C21 N041 0 6.8p Cpar=1p
C22 N043 0 6.8p Cpar=1p
C23 N045 0 6.8p Cpar=1p
C24 N047 0 6.8p Cpar=1p
C25 N049 0 6.8p Cpar=1p
C26 N051 0 6.8p Cpar=1p
C27 N053 0 6.8p Cpar=1p
.tran 300n
.backanno
.end